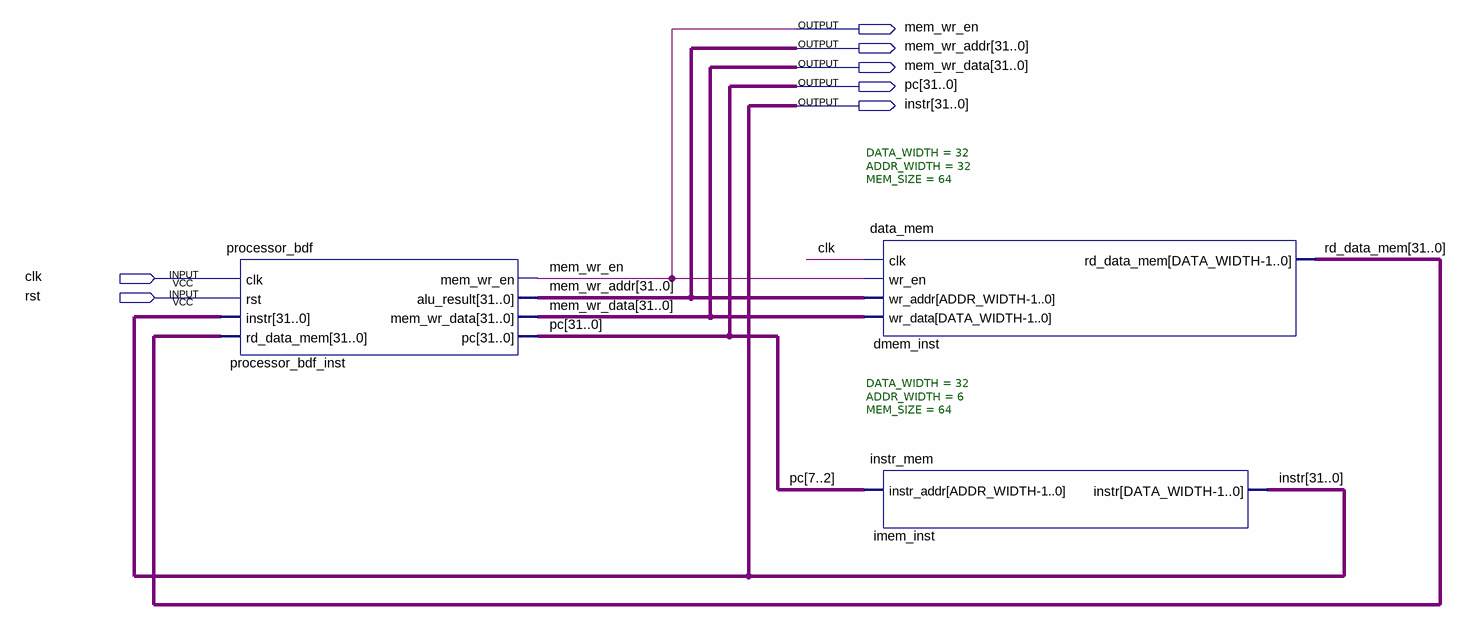
[diagram p0: schematic sheet]
// Quartus schematic mips32_single_cycle_design.bdf as structural Verilog: 3 symbols, 7 pins
module mips32_single_cycle_design (
  input  clk,
  input  rst,
  output mem_wr_en,
  output [31:0] mem_wr_addr,
  output [31:0] mem_wr_data,
  output [31:0] pc,
  output [31:0] instr
);

  wire [31:0] rd_data_mem;

  processor_bdf processor_bdf_inst (
    .clk(clk), .rst(rst), .instr(instr), .rd_data_mem(rd_data_mem), .mem_wr_en(mem_wr_en),
    .alu_result(mem_wr_addr), .mem_wr_data(mem_wr_data), .pc(pc));
  data_mem #(.DATA_WIDTH(32), .ADDR_WIDTH(32), .MEM_SIZE(64)) dmem_inst (
    .clk(clk), .wr_en(mem_wr_en), .wr_addr(mem_wr_addr), .wr_data(mem_wr_data), .rd_data_mem(rd_data_mem));
  instr_mem #(.DATA_WIDTH(32), .ADDR_WIDTH(6), .MEM_SIZE(64)) imem_inst (.instr_addr(pc[7:2]), .instr(instr));
endmodule
